# Altium schematic sheet DACEWAVE.SchDoc: DACEWAVE
size A4
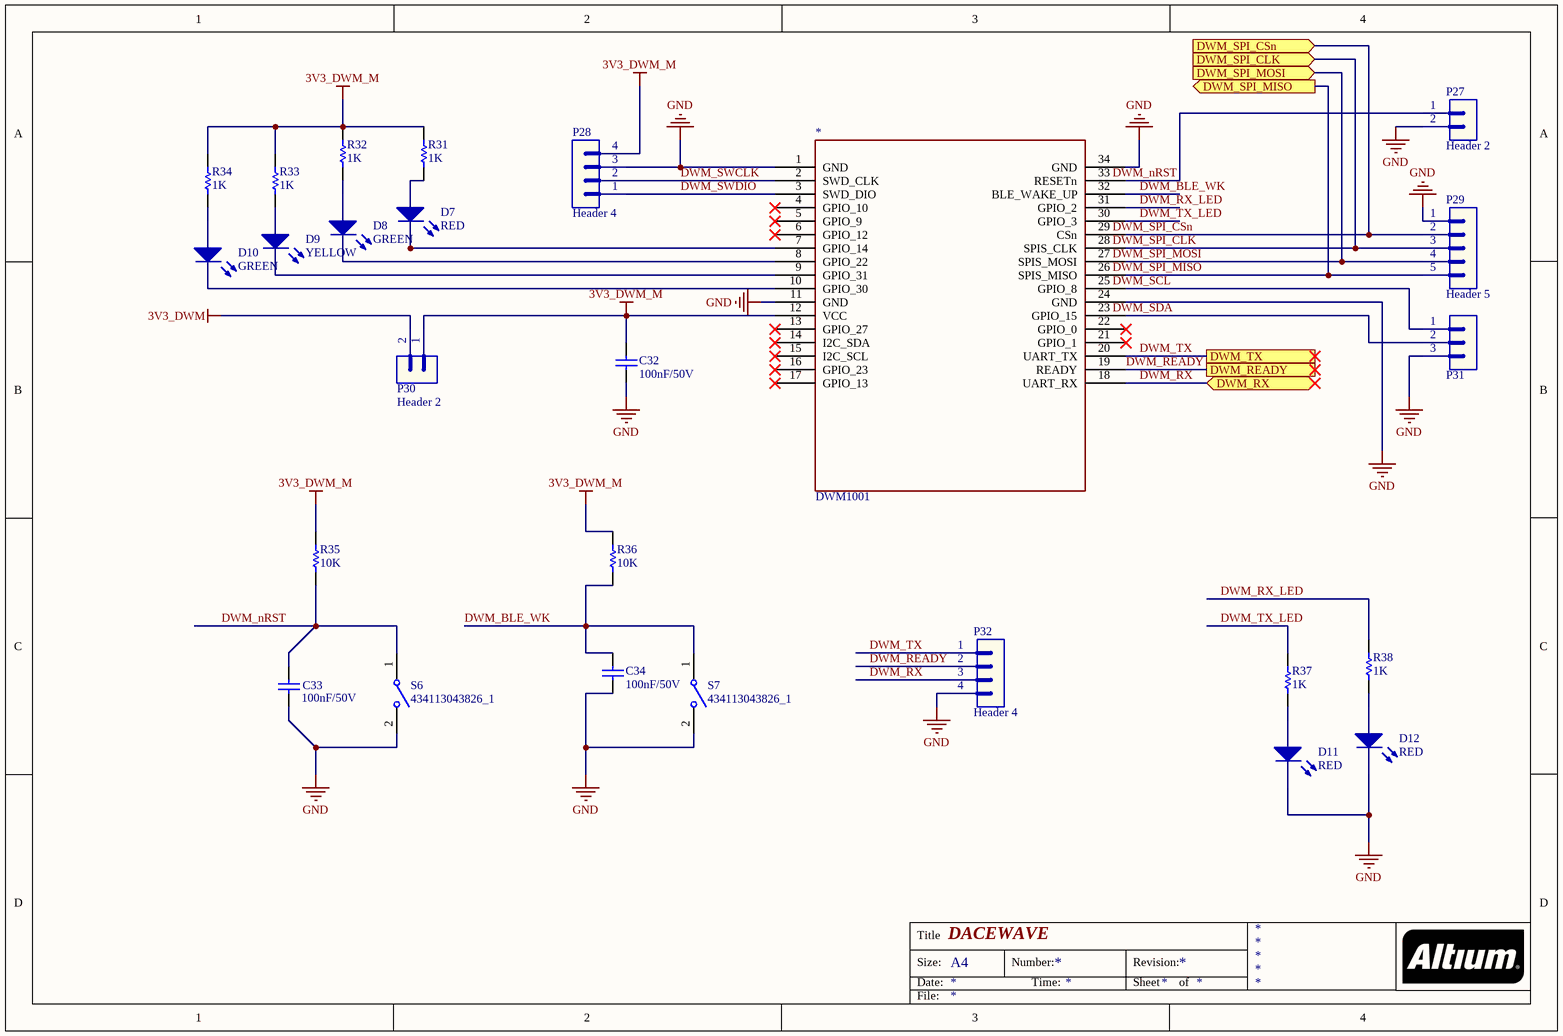
[diagram p0: DACEWAVE.SchDoc]

## Parts
*  DWM1001  [DWM1001]
C32  value 100nF/50V  [CAP-SM-0805]  (hidden comment: Cap-100nF-50V-0805)
C33  value 100nF/50V  [CAP-SM-0805]  (hidden comment: Cap-100nF-50V-0805)
C34  value 100nF/50V  [CAP-SM-0805]  (hidden comment: Cap-100nF-50V-0805)
D7  RED  [LED_0805_Blue]
D8  GREEN  [LED_0805_Blue]
D9  YELLOW  [LED_0805_Blue]
D10  GREEN  [LED_0805_Blue]
D11  RED  [LED_0805_Blue]
D12  RED  [LED_0805_Blue]
P27  Header 2  [JP2]
P28  Header 4  [JP4]
P29  Header 5  [JP5]
P30  Header 2  [JP2]
P31  Header 3  [JP3]  (value not drawn)
P32  Header 4  [JP4]
R31  value 1K  [RES-SM-0805]  (hidden comment: Res-0-0805)
R32  value 1K  [RES-SM-0805]  (hidden comment: Res-0-0805)
R33  value 1K  [RES-SM-0805]  (hidden comment: Res-0-0805)
R34  value 1K  [RES-SM-0805]  (hidden comment: Res-0-0805)
R35  value 10K  [RES-SM-0805]  (hidden comment: Res-0-0805)
R36  value 10K  [RES-SM-0805]  (hidden comment: Res-0-0805)
R37  value 1K  [RES-SM-0805]  (hidden comment: Res-0-0805)
R38  value 1K  [RES-SM-0805]  (hidden comment: Res-0-0805)
S6  434113043826_1  [434113043826]
S7  434113043826_1  [434113043826]

## Ports
DWM_READY, DWM_RX (bidir), DWM_SPI_CLK (in), DWM_SPI_CSn (in), DWM_SPI_MISO (out), DWM_SPI_MOSI (in), DWM_TX

## Nets
3V3_DWM: P30.2
3V3_DWM_M: *.12(VCC) C32.1 P28.4 P30.1 R31.2 R32.2 R33.2 R34.2 R35.2 R36.2
GND: *.1(GND) *.11(GND) *.24(GND) *.34(GND) C32.2 C33.2 C34.2 D11.2(K) D12.2(K) P27.2 P28.3 P29.1 P31.3 P32.4 S6.2 S7.2
DWM_BLE_WK: *.32(BLE_WAKE_UP) C34.1 R36.1 S7.1
DWM_nRST: C33.1 R35.1 S6.1
DWM_READY: *.19(READY) P32.2 ; port DWM_READY
DWM_RX: *.18(UART_RX) P32.3 ; port DWM_RX
DWM_RX_LED: *.31(GPIO_2) R38.2
DWM_SPI_CLK: *.28(SPIS_CLK) P29.3 ; port DWM_SPI_CLK
DWM_SPI_CSn: *.29(CSn) P29.2 ; port DWM_SPI_CSn
DWM_SPI_MISO: *.26(SPIS_MISO) P29.5 ; port DWM_SPI_MISO
DWM_SPI_MOSI: *.27(SPIS_MOSI) P29.4 ; port DWM_SPI_MOSI
DWM_SWCLK: *.2(SWD_CLK) P28.2
DWM_SWDIO: *.3(SWD_DIO) P28.1
DWM_TX: *.20(UART_TX) P32.1 ; port DWM_TX
DWM_TX_LED: *.30(GPIO_3) R37.2
Net*_7: *.7(GPIO_14) D7.2(K)
Net*_8: *.8(GPIO_22) D8.2(K)
Net*_9: *.9(GPIO_31) D9.2(K)
Net*_10: *.10(GPIO_30) D10.2(K)
Net*_23: *.23(GPIO_15) P31.2
Net*_25: *.25(GPIO_8) P31.1
Net*_33: *.33(RESETn) P27.1
NetD7_1: D7.1(A) R31.1
NetD8_1: D8.1(A) R32.1
NetD9_1: D9.1(A) R33.1
NetD10_1: D10.1(A) R34.1
NetD11_1: D11.1(A) R37.1
NetD12_1: D12.1(A) R38.1

Not connected (* = marked no-connect by the designer): * 4(GPIO_10)* 5(GPIO_9)* 6(GPIO_12)* 13(GPIO_27)* 14(I2C_SDA)* 15(I2C_SCL)* 16(GPIO_23)* 17(GPIO_13)* 21(GPIO_1)* 22(GPIO_0)*

## Notes on the sheet
- Labels drawn without touching a wire or pin: DWM_nRST, DWM_SCL, DWM_SDA, DWM_SPI_CLK, DWM_SPI_CSn, DWM_SPI_MISO, DWM_SPI_MOSI
- Title
- Size:
- Date:
- A4
- Number:
- Time:
- Revision:
- Sheet
- of
- File:

## Library data of the parts
C32-C34 = Cap-100nF-50V-0805: CAP CER 0.1UF 50V Y5V 0805; Manufacturer: Samsung Electro-Mechanics; Manufacturer Part Number: CL21F104ZBCNNNC; Local Supplier: thegioiic; Local Supplier Link: https://thegioiic.com/products/tu-100nf-0-1uf-50v-0805; Supplier 1: Digikey; Supplier 1 Part Number: 1276-1007-1-ND; Supplier 1 Link: https://www.digikey.com/product-detail/en/samsung-electro-mechanics/CL21F104ZBCNNNC/1276-1007-1-ND/3889093
D7-D12 = LED
P27 P30 = Header 2: Header, 2-Pin; LatestRevisionDate: 17-Jul-2002; LatestRevisionNote: Re-released for DXP Platform.; Publisher: Altium Limited
P28 P32 = Header 4: Header, 4-Pin; LatestRevisionDate: 17-Jul-2002; LatestRevisionNote: Re-released for DXP Platform.; Publisher: Altium Limited
P29 = Header 5: Header, 5-Pin; LatestRevisionDate: 17-Jul-2002; LatestRevisionNote: Re-released for DXP Platform.; Publisher: Altium Limited
P31 = Header 3: Header, 3-Pin; LatestRevisionDate: 17-Jul-2002; LatestRevisionNote: Re-released for DXP Platform.; Publisher: Altium Limited
R31-R38 = Res-0-0805: RES 0 OHM JUMPER 0805; Manufacturer: Vishay Dale; Manufacturer Part Number: WSL080500000ZEA9; Local Supplier: thegioiic; Local Supplier Link: https://thegioiic.com/products/dien-tro-0-ohm-0805-5; Supplier 1: Digikey; Supplier 1 Link: https://www.digikey.com/product-detail/en/vishay-dale/WSL080500000ZEA9/541-3928-1-ND/7423223; Supplier 1 Part Number: 541-3928-1-ND
S6 S7 = 434113043826_1: WS-TASV J-Bend SMT Tact Switch 6x3.5mm, height 4.3mm, 260gf; Rated Voltage: 12VDC; Rated Current: 50mA; Washable: No; ComponentLink1Description: Manufacturer; ComponentLink1URL: http://www.we-online.de; ComponentLink2Description: Datasheet; ComponentLink2URL: https://katalog.we-online.com/em/datasheet/434113043826.pdf; Operating Temperature: -40 to +85degC; Part Number: 434113043826; Published Date: September 2019; Contact Material: Stainless Steel; Height: 4.3mm; Mounting Technology: SMT; Contact Plating: Silver; Operation Force: 260gf; Packaging: Tape and Reel; Terminal Material: Copper Alloy; Publisher: Wurth Elektronik; Terminal Plating: Silver